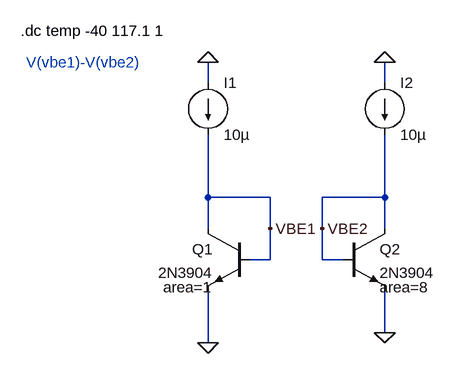
[diagram p0: schematic PTAT.asc]
PTAT.asc, the LTspice schematic file:
Version 4.1
SHEET 1 880 680
WIRE 208 112 208 80
WIRE 480 112 480 80
WIRE 208 288 208 192
WIRE 304 288 208 288
WIRE 480 288 480 192
WIRE 480 288 384 288
WIRE 208 336 208 288
WIRE 304 336 304 288
WIRE 384 336 384 288
WIRE 480 336 480 288
WIRE 304 384 304 336
WIRE 304 384 272 384
WIRE 384 384 384 336
WIRE 416 384 384 384
WIRE 480 496 480 432
WIRE 208 512 208 432
FLAG 208 512 0
FLAG 480 496 0
FLAG 208 80 0
FLAG 304 336 VBE1
FLAG 384 336 VBE2
FLAG 480 80 0
SYMBOL current 208 112 R0
SYMATTR InstName I1
SYMATTR Value 10µ
SYMBOL npn 272 336 M0
WINDOW 39 56 90 Left 2
SYMATTR SpiceLine area=1
SYMATTR InstName Q1
SYMATTR Value 2N3904
SYMBOL npn 416 336 R0
WINDOW 39 56 90 Left 2
SYMATTR SpiceLine area=8
SYMATTR InstName Q2
SYMATTR Value 2N3904
SYMBOL current 480 112 R0
SYMATTR InstName I2
SYMATTR Value 10µ
TEXT -80 32 Left 2 !.dc temp -40 117.1 1
TEXT -72 80 Left 2 ;V(vbe1)-V(vbe2)

The netlist it stands for:
* PTAT.asc
I1 0 VBE1 10µ
Q1 VBE1 VBE1 0 0 2N3904 area=1
Q2 VBE2 VBE2 0 0 2N3904 area=8
I2 0 VBE2 10µ
.model NPN NPN
.model PNP PNP
.lib standard.bjt
.dc temp -40 117.1 1
* V(vbe1)-V(vbe2)
.backanno
.end